# Altium schematic sheet DistanceSensors.SchDoc: Distance Sensors
size A4; Date: 2022 Fall; Address1: LK Bulls; Address2: Bagoly Zoltan; Address3: Feher Daniel; Address4: G. Varga Gabor; DocumentNumber: 7; Revision: 1.0; SheetNumber: 7; SheetTotal: 14
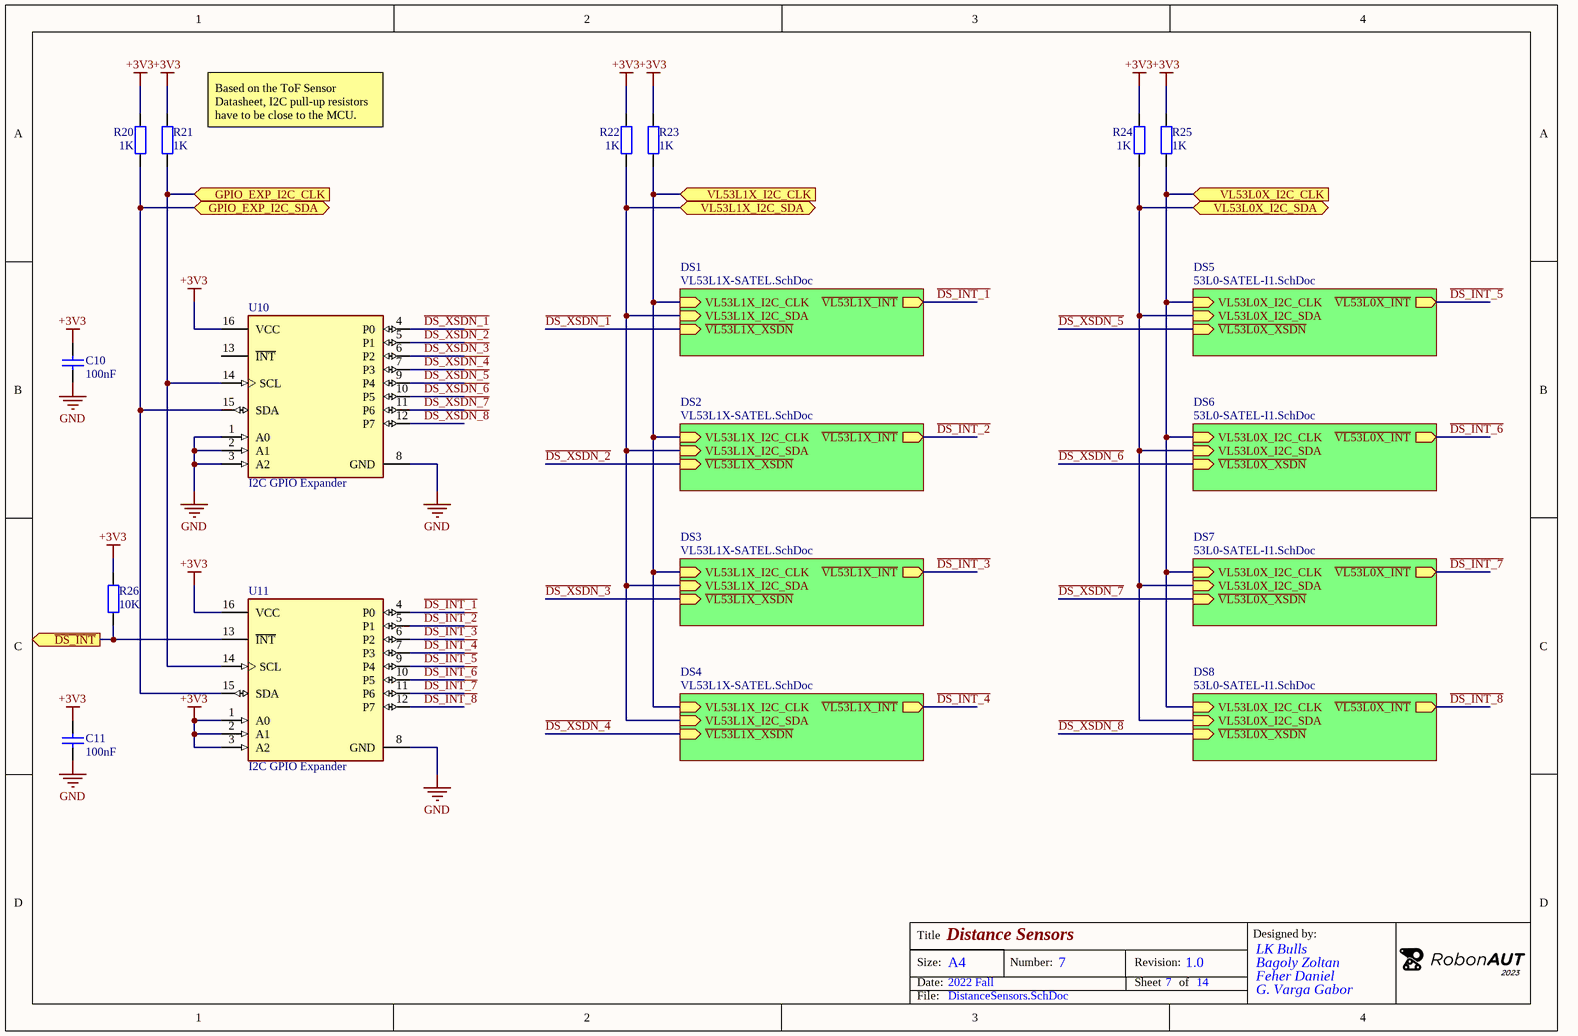
[diagram p0: DistanceSensors.SchDoc]

## Parts
C10  100nF  [FP_0805_CAP_085]
C11  100nF  [FP_0805_CAP_085]
R20  1K  [FP_0805_RES]
R21  1K  [FP_0805_RES]
R22  1K  [FP_0805_RES]
R23  1K  [FP_0805_RES]
R24  1K  [FP_0805_RES]
R25  1K  [FP_0805_RES]
R26  10K  [FP_0805_RES]
U10  I2C GPIO Expander  [FP_TCA9534PWR]
U11  I2C GPIO Expander  [FP_TCA9534PWR]

## Sub-sheets
DS1 = VL53L1X-SATEL.SchDoc: VL53L1X_I2C_CLK (in), ~{VL53L1X_XSDN} (in), VL53L1X_I2C_SDA (in), ~{VL53L1X_INT} (out)
DS2 = VL53L1X-SATEL.SchDoc: VL53L1X_I2C_CLK (in), ~{VL53L1X_XSDN} (in), VL53L1X_I2C_SDA (in), ~{VL53L1X_INT} (out)
DS3 = VL53L1X-SATEL.SchDoc: VL53L1X_I2C_CLK (in), ~{VL53L1X_XSDN} (in), VL53L1X_I2C_SDA (in), ~{VL53L1X_INT} (out)
DS4 = VL53L1X-SATEL.SchDoc: VL53L1X_I2C_CLK (in), ~{VL53L1X_XSDN} (in), VL53L1X_I2C_SDA (in), ~{VL53L1X_INT} (out)
DS5 = 53L0-SATEL-I1.SchDoc: VL53L0X_I2C_CLK (in), ~{VL53L0X_XSDN} (in), VL53L0X_I2C_SDA (in), ~{VL53L0X_INT} (out)
DS6 = 53L0-SATEL-I1.SchDoc: VL53L0X_I2C_CLK (in), ~{VL53L0X_XSDN} (in), VL53L0X_I2C_SDA (in), ~{VL53L0X_INT} (out)
DS7 = 53L0-SATEL-I1.SchDoc: VL53L0X_I2C_CLK (in), ~{VL53L0X_XSDN} (in), VL53L0X_I2C_SDA (in), ~{VL53L0X_INT} (out)
DS8 = 53L0-SATEL-I1.SchDoc: VL53L0X_I2C_CLK (in), ~{VL53L0X_XSDN} (in), VL53L0X_I2C_SDA (in), ~{VL53L0X_INT} (out)

## Ports
GPIO_EXP_I2C_CLK (in), GPIO_EXP_I2C_SDA (bidir), VL53L0X_I2C_CLK (in), VL53L0X_I2C_SDA (bidir), VL53L1X_I2C_CLK (in), VL53L1X_I2C_SDA (bidir), ~{DS_INT} (out)

## Nets
+3V3: C10.2 C11.2 R20.2 R21.2 R22.2 R23.2 R24.2 R25.2 R26.2 U10.16(VCC) U11.1(A0) U11.2(A1) U11.3(A2) U11.16(VCC)
GND: C10.1 C11.1 U10.1(A0) U10.2(A1) U10.3(A2) U10.8(GND) U11.8(GND)
~{DS_INT}: R26.1 U11.13(~{INT}) ; port ~{DS_INT}
~{DS_INT_1}: U11.4(P0) ; sheet DS1/~{VL53L1X_INT}
~{DS_INT_2}: U11.5(P1) ; sheet DS2/~{VL53L1X_INT}
~{DS_INT_3}: U11.6(P2) ; sheet DS3/~{VL53L1X_INT}
~{DS_INT_4}: U11.7(P3) ; sheet DS4/~{VL53L1X_INT}
~{DS_INT_5}: U11.9(P4) ; sheet DS5/~{VL53L0X_INT}
~{DS_INT_6}: U11.10(P5) ; sheet DS6/~{VL53L0X_INT}
~{DS_INT_7}: U11.11(P6) ; sheet DS7/~{VL53L0X_INT}
~{DS_INT_8}: U11.12(P7) ; sheet DS8/~{VL53L0X_INT}
~{DS_XSDN_1}: U10.4(P0) ; sheet DS1/~{VL53L1X_XSDN}
~{DS_XSDN_2}: U10.5(P1) ; sheet DS2/~{VL53L1X_XSDN}
~{DS_XSDN_3}: U10.6(P2) ; sheet DS3/~{VL53L1X_XSDN}
~{DS_XSDN_4}: U10.7(P3) ; sheet DS4/~{VL53L1X_XSDN}
~{DS_XSDN_5}: U10.9(P4) ; sheet DS5/~{VL53L0X_XSDN}
~{DS_XSDN_6}: U10.10(P5) ; sheet DS6/~{VL53L0X_XSDN}
~{DS_XSDN_7}: U10.11(P6) ; sheet DS7/~{VL53L0X_XSDN}
~{DS_XSDN_8}: U10.12(P7) ; sheet DS8/~{VL53L0X_XSDN}
GPIO_EXP_I2C_CLK: R21.1 U10.14(SCL) U11.14(SCL) ; port GPIO_EXP_I2C_CLK
GPIO_EXP_I2C_SDA: R20.1 U10.15(SDA) U11.15(SDA) ; port GPIO_EXP_I2C_SDA
VL53L0X_I2C_CLK: R25.1 ; port VL53L0X_I2C_CLK, sheet DS5/VL53L0X_I2C_CLK, sheet DS6/VL53L0X_I2C_CLK, sheet DS7/VL53L0X_I2C_CLK, sheet DS8/VL53L0X_I2C_CLK
VL53L0X_I2C_SDA: R24.1 ; port VL53L0X_I2C_SDA, sheet DS5/VL53L0X_I2C_SDA, sheet DS6/VL53L0X_I2C_SDA, sheet DS7/VL53L0X_I2C_SDA, sheet DS8/VL53L0X_I2C_SDA
VL53L1X_I2C_CLK: R23.1 ; port VL53L1X_I2C_CLK, sheet DS1/VL53L1X_I2C_CLK, sheet DS2/VL53L1X_I2C_CLK, sheet DS3/VL53L1X_I2C_CLK, sheet DS4/VL53L1X_I2C_CLK
VL53L1X_I2C_SDA: R22.1 ; port VL53L1X_I2C_SDA, sheet DS1/VL53L1X_I2C_SDA, sheet DS2/VL53L1X_I2C_SDA, sheet DS3/VL53L1X_I2C_SDA, sheet DS4/VL53L1X_I2C_SDA

Not connected (* = marked no-connect by the designer): U10 13(~{INT})

## Notes on the sheet
- (near R21) Based on the ToF Sensor Datasheet, I2C pull-up resistors have to be close to the MCU.
- Title
- Size:
- Date:
- A4
- Number:
- Revision:
- Sheet
- of
- Designed by:
- File:

## Library data of the parts
C10 C11 = CAP: Capacitor; Tolerance: 10%; Voltage: 50V; Name: 100nF 0805 10% 50V X7R 0805B104K500NT (FNG); Supplier: Lomex; Reference: 82-13-46; Value: 100nF
R20-R25 = RES: Resistor; Tolerance: 5%; Power: 0.125W; Name: 1K00 0805 5% CR-05JL7----1K 0.125W (VIK); Supplier: Lomex; Reference: 81-10-87; Value: 1K
R26 = RES: Resistor; Tolerance: 5%; Power: 0.125W; Name: 10K0 0805 5% CR-05JL7---10K 0.125W (VIK); Supplier: Lomex; Reference: 81-10-99; Value: 10K
U10 U11 = TCA9534PWR: I2C/SMBus Interface 100kHz/400kHz 5.5V 16-Pin TSSOP T/R; Manufacturer: Texas Instruments; Number of I/Os: 8; Frequency: 400kHz; Reference: 595-TCA9534PWR; Name: TCA9534PWR 8 Bit I2C I/O Expander; Supplier 1: Mouser; Manufacturer Part Number: TCA9534PWR; RoHS: Yes; Category: Interface ICs; Stock 1: 8871; Pricing 1: 1=1,44000, 10=1,30000, 25=1,23000, 50=1,23000, 100=1,01000, 250=0,94400, 500=0,83400, 1000=0,65900, 2000=0,63600, 10000=0,63600 (USD); Mount: Surface Mount; Case/Package: TSSOP; Number of Pins: 16; Min Operating Temperature: -40°C; Max Operating Temperature: 85°C; Packaging: Tape and Reel; Interface: I2C; Number of Outputs: 8; Lead Free: Lead Free; RoHS Compliant: Yes; ComponentLink1URL: https://datasheet.ciiva.com/48508/tca9534-48508117.pdf?src-supplier=Avnet; ComponentLink1Description: https://datasheet.ciiva.com/48508/tca9534-48508117.pdf?src-supplier=Avnet; Supplier Part Number 1: 595-TCA9534PWR; Supplier: Mouser